# EAGLE design PowerBoard (EAGLE 9.6.2)
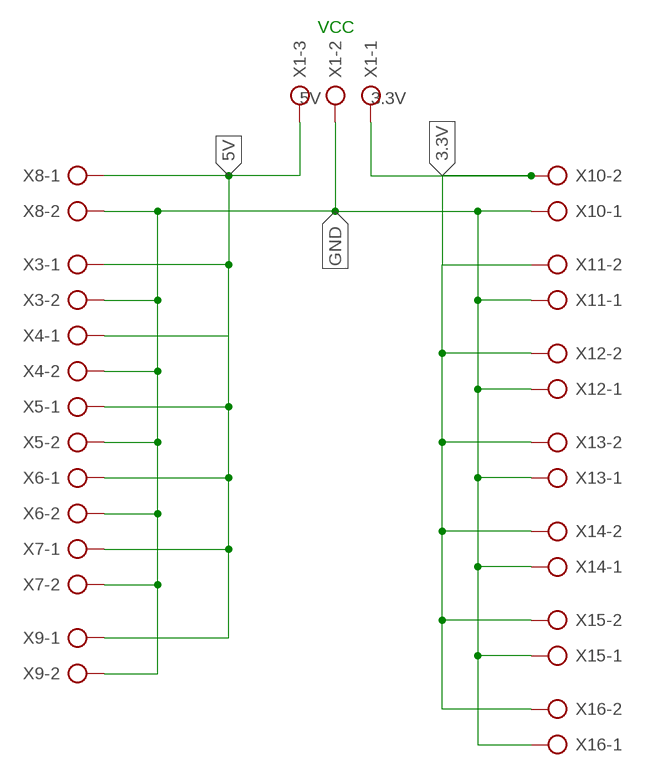
[diagram p0: schematic, sheet 1]

## Parts
X1  AK500/3  [AK500/3]
X3  AK500/2  [AK500/2]
X4  AK500/2  [AK500/2]
X5  AK500/2  [AK500/2]
X6  AK500/2  [AK500/2]
X7  AK500/2  [AK500/2]
X8  AK500/2  [AK500/2]
X9  AK500/2  [AK500/2]
X10  AK500/2  [AK500/2]
X11  AK500/2  [AK500/2]
X12  AK500/2  [AK500/2]
X13  AK500/2  [AK500/2]
X14  AK500/2  [AK500/2]
X15  AK500/2  [AK500/2]
X16  AK500/2  [AK500/2]

## Nets
3.3V: X1.1 X10.2 X11.2 X12.2 X13.2 X14.2 X15.2 X16.2
5V: X1.3 X3.1 X4.1 X5.1 X6.1 X7.1 X8.1 X9.1
GND: X1.2 X3.2 X4.2 X5.2 X6.2 X7.2 X8.2 X9.2 X10.1 X11.1 X12.1 X13.1 X14.1 X15.1 X16.1

## Notes on the sheet
- VCC
- 5V | 3.3V

## Library data of the parts
X1 = con-ptr500:AK500/3: CONNECTOR; OC_FARNELL: unknown; OC_NEWARK: unknown
X3-X16 = con-ptr500:AK500/2: CONNECTOR; OC_FARNELL: unknown; OC_NEWARK: unknown

## Board
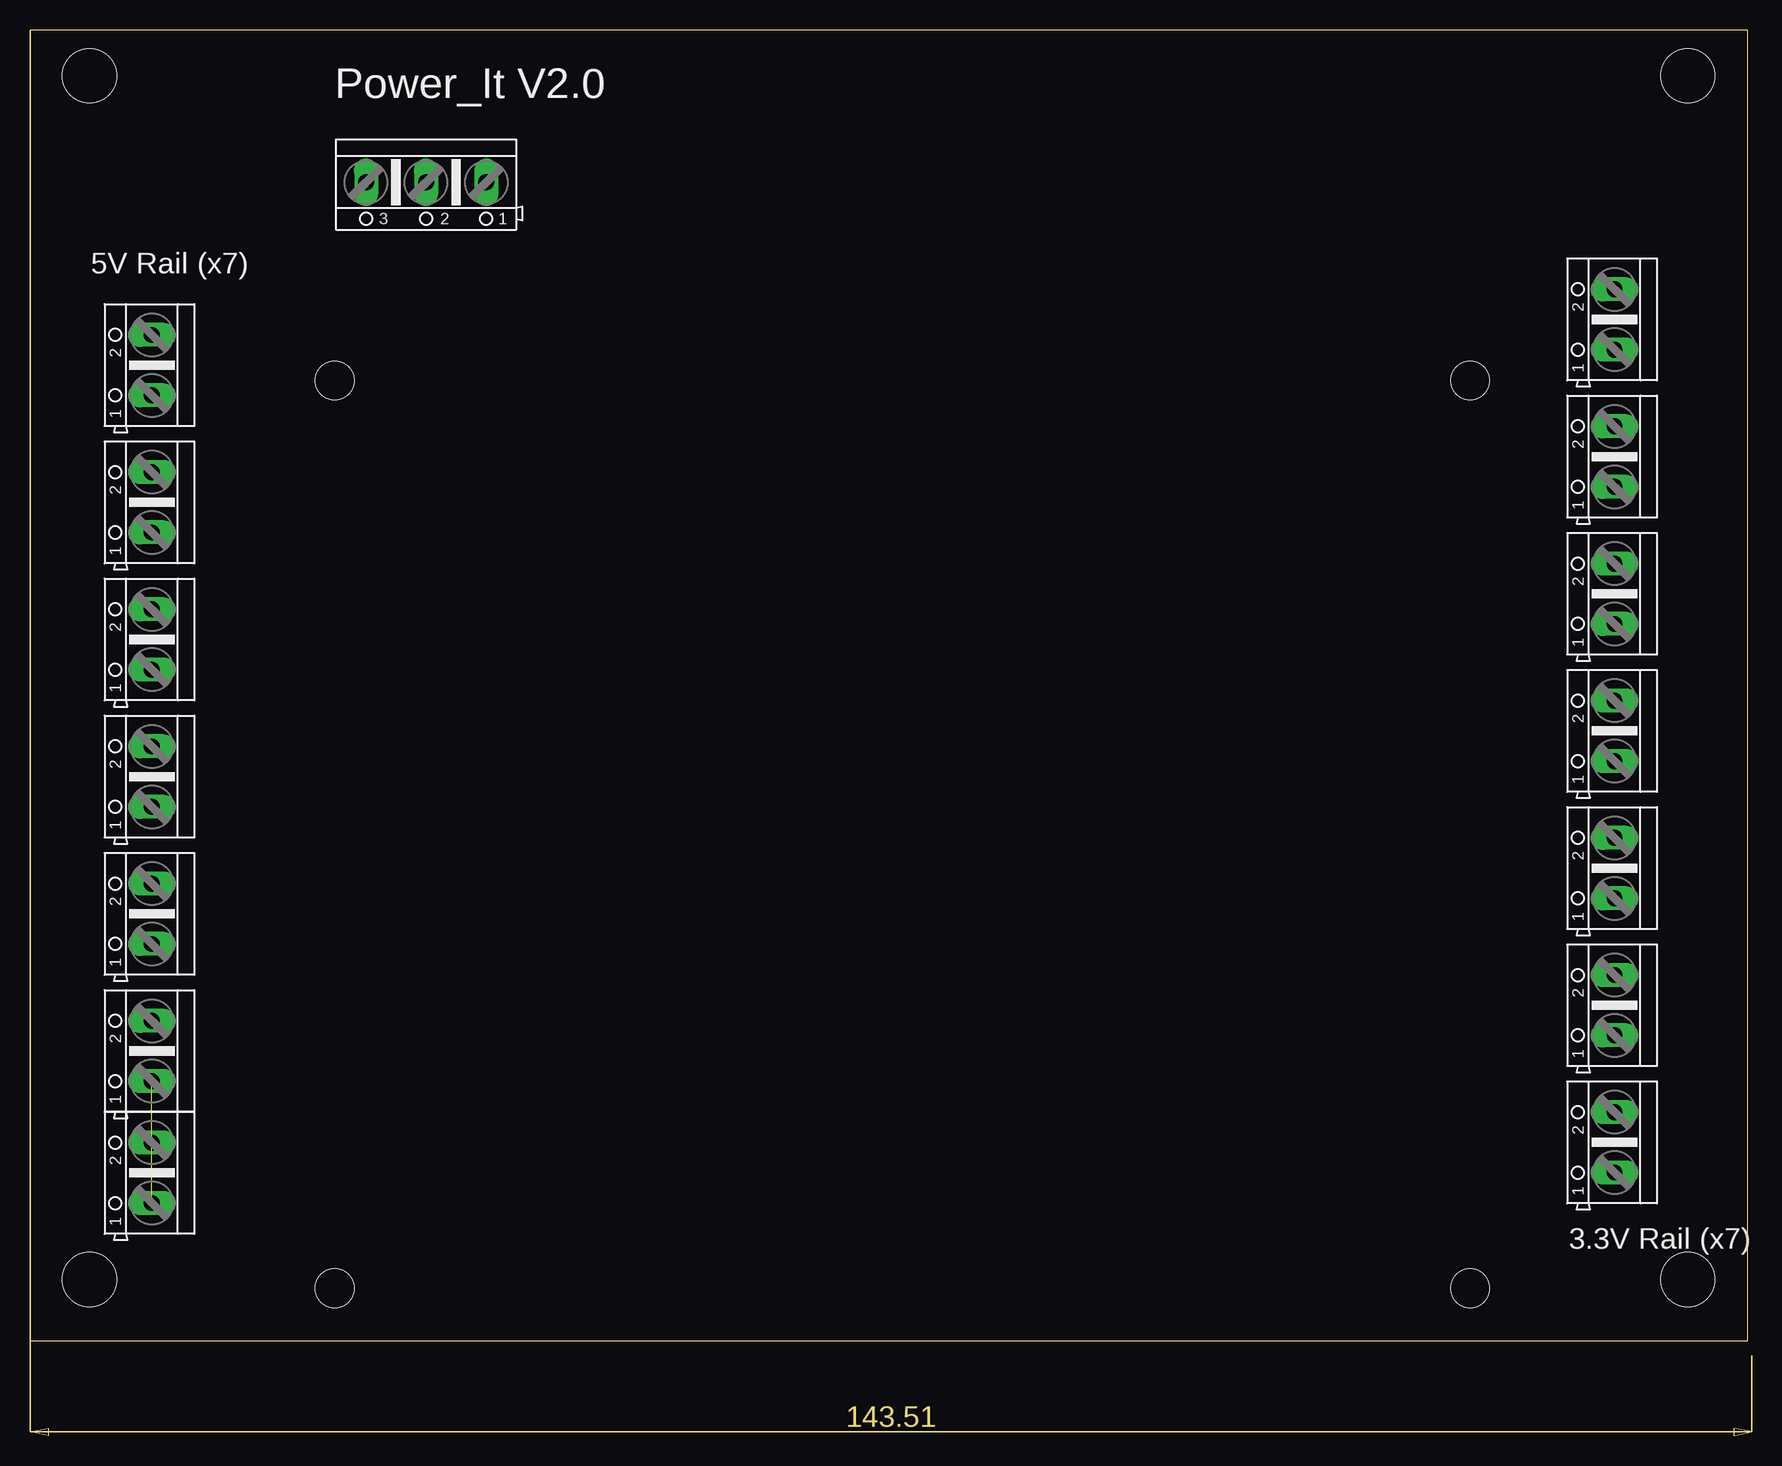
[diagram p1: board, top side]
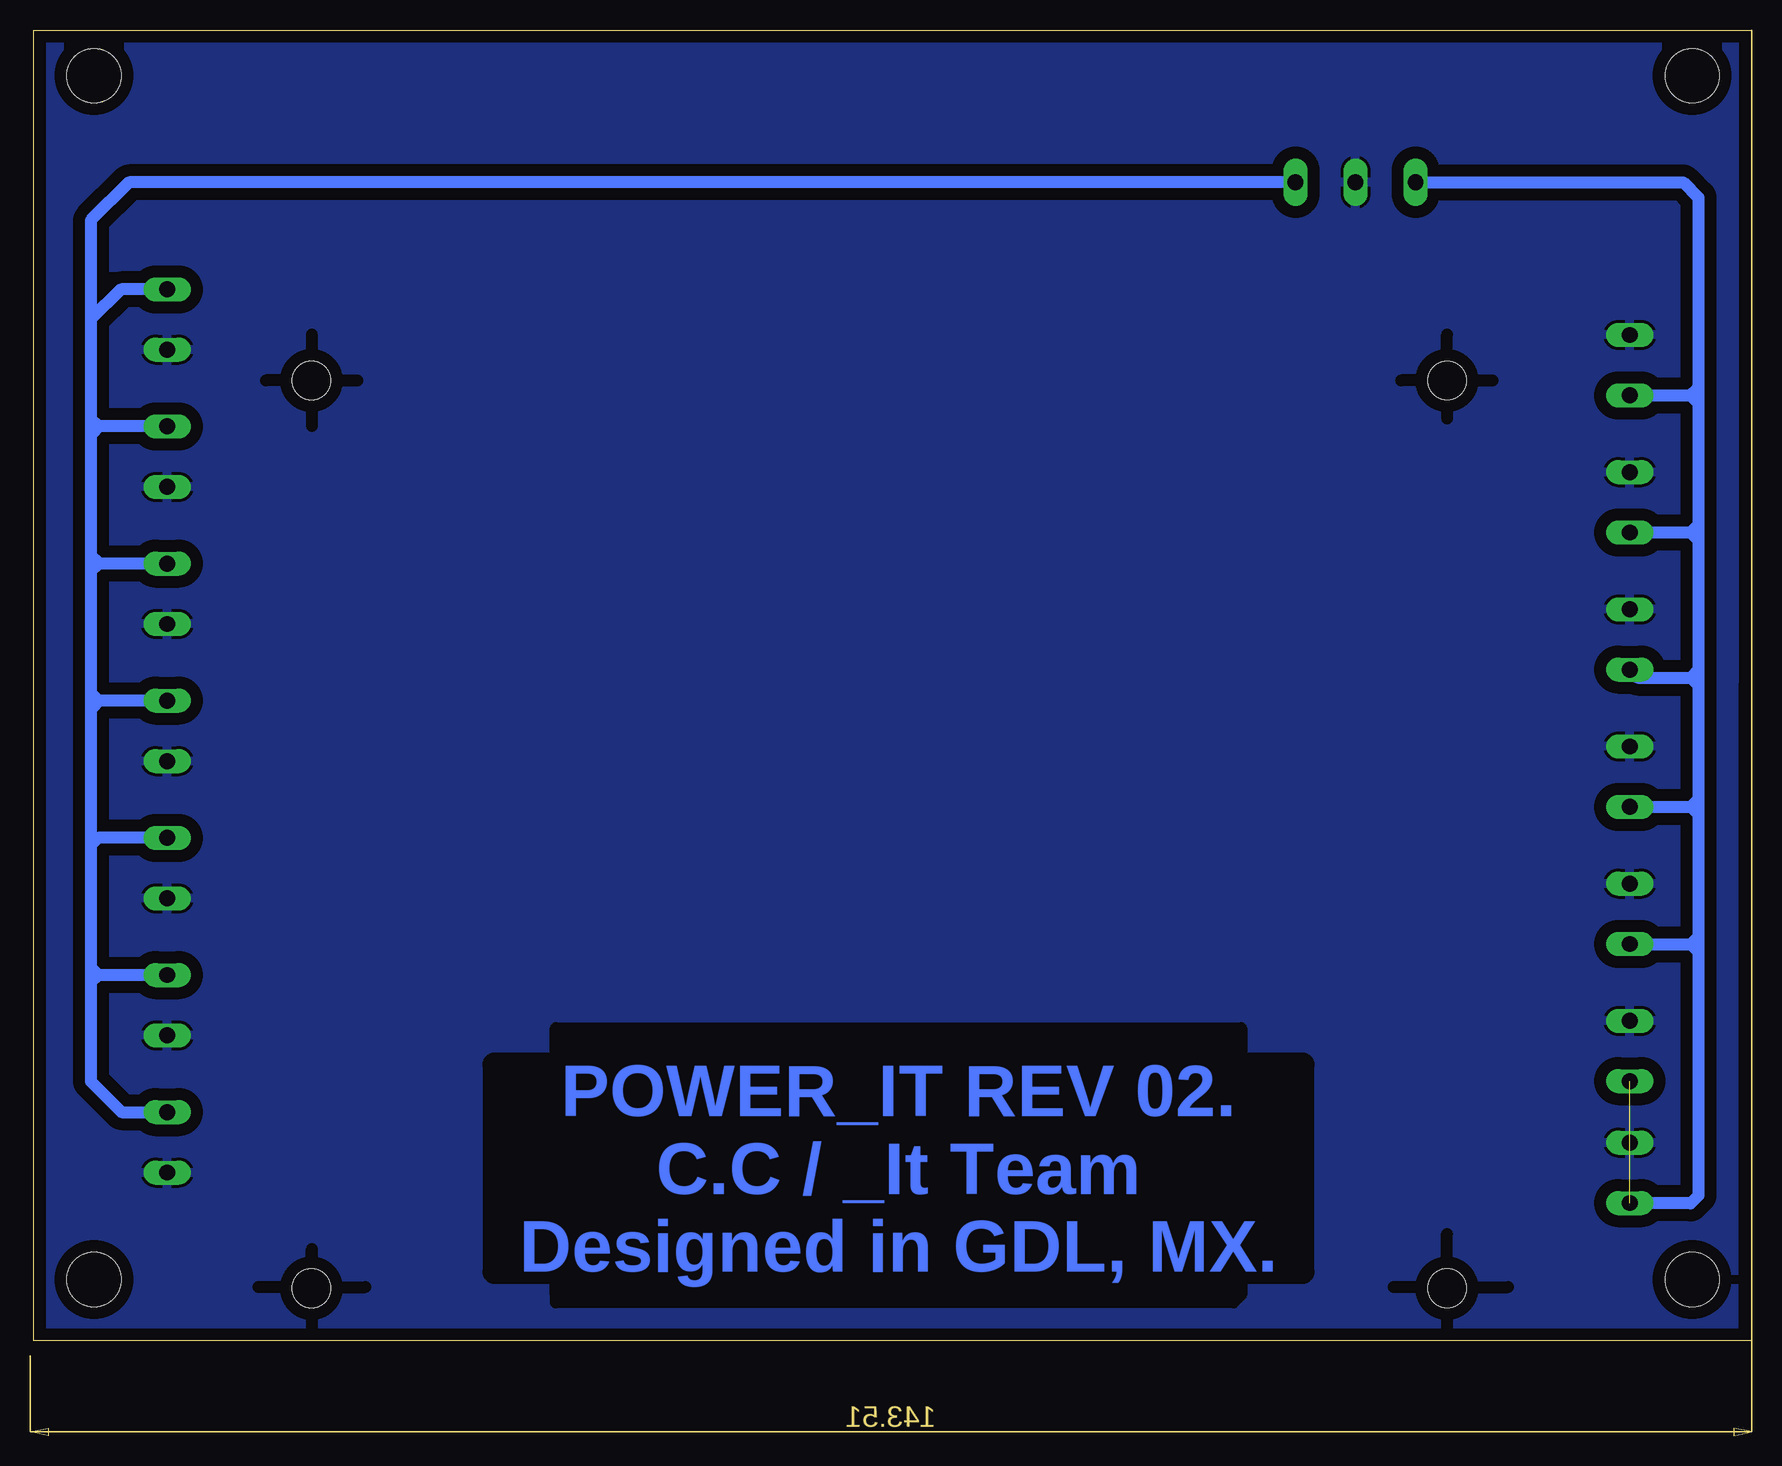
[diagram p2: board, bottom side, seen from below]

Size 143.18 x 109.21 mm. Coordinates in mm from the lower left corner, seen from the top.
Outline: 0,0 143.18,0 143.18,109.21 0,109.21 0,0
Copper layers (1*16): Top 0.035mm / dielectric 1.5mm / Bottom 0.035mm
Design rules "PowerBoard": minimum track width 1mm, minimum drill 0.35mm, track to track 1mm, track to pad 1mm, pad to pad 0.205mm, via to via 0.205mm, smd to smd 6mil, copper to edge 40mil, drill to drill 6mil, minimum pad ring 10mil, minimum via ring 8mil, stop-mask expansion 4mil, vias tented up to drill 0mil, thermal gap 10mil
Holes 3.2 mm at 25.4,4.36 25.4,80.01 120.05,4.36 120.05,80.01
Holes 4.5 mm at 4.95,5.08 4.95,105.41 138.18,105.41 138.18,5.08
bRestrict: 23 lines

### Footprints (pad centres in the part's own frame; a part is rotated, then mirrored left to right if it is on the bottom)
AK500/3 = drill 1.321 long: 1 -5.004,0; 2 0,0; 3 5.004,0
AK500/2 = drill 1.321 long: 1 -2.515,0; 2 2.515,0

### Placement (x,y rotation side)
X1  33.02,96.52 180 top
X3  10.16,81.28 90 top
X4  10.16,69.85 90 top
X5  10.16,58.42 90 top
X6  10.16,46.99 90 top
X7  10.16,35.56 90 top
X8  10.16,24.13 90 top
X9  10.16,13.97 90 top
X10  132.08,85.09 90 top
X11  132.08,73.66 90 top
X12  132.08,62.23 90 top
X13  132.08,50.8 90 top
X14  132.08,39.37 90 top
X15  132.08,27.94 90 top
X16  132.08,16.51 90 top

### Tracks (layer width: path | path; a pad name or v marks a point on that pad's centre or on a via)
3.3V
  Bottom 1.016: X10.2 135.91,87.61 138.43,85.09 | X16.2 135.87,19.02 138.43,21.59 138.43,29.84 | 138.43,85.09 138.43,76.83 | 138.43,76.83 138.43,75.56 | 138.43,75.56 138.43,65.41 | 138.43,65.41 138.43,64.14 | 138.43,64.14 138.43,53.98 | 138.43,53.98 138.43,52.7 | 138.43,52.7 138.43,41.27 | 138.43,41.27 138.43,31.11 | 138.43,31.11 138.43,29.84 | X11.2 137.77,76.17 | 138.43,76.83 137.77,76.17 | X12.2 137.82,64.75 | 138.43,64.14 137.82,64.75 | X13.2 137.77,53.31 | 138.43,53.98 137.77,53.31 | X14.2 137.82,41.88 138.43,41.27 | X15.2 137.77,30.45 | 137.77,30.45 138.43,31.11 | X1.1 135.25,96.52 138.43,93.34 138.43,85.09 | 137.77,76.17 138.38,75.56 138.43,75.56 | 137.82,64.75 137.82,64.8 138.43,65.41 | 137.77,53.31 138.38,52.7 138.43,52.7 | 137.77,30.45 137.82,30.45 138.43,29.84
5V  (1 unrouted)
  Bottom 1.016: 4.45,78.11 5.11,78.77 | 4.45,78.11 4.45,67.94 | 4.45,67.94 4.45,67.31 | 4.45,67.31 4.45,66.67 | 4.45,66.67 4.45,55.88 | 4.45,55.88 4.45,55.24 | 4.45,55.24 4.45,54.61 | 4.45,54.61 4.45,45.09 | 4.45,45.09 4.45,44.45 | 4.45,44.45 4.45,43.84 | 4.45,43.84 4.45,33.66 | 4.45,33.66 4.45,33.02 | 4.45,33.02 4.45,32.38 | 4.45,32.38 4.45,12.06 5.08,11.43 10.13,11.43 X9.1 | X4.1 5.08,67.33 | 5.08,67.33 4.47,67.33 4.45,67.31 | X5.1 9.5,55.24 5.08,55.24 | 5.08,55.24 4.45,55.24 | X6.1 5.08,44.48 | 5.08,44.48 4.47,44.48 4.45,44.45 | X7.1 10.13,33.02 5.08,33.02 | 5.08,33.02 4.45,33.02 | X3.1 5.11,78.77 | X1.3 5.71,96.52 4.45,95.25 4.45,79.38 | 4.45,79.38 4.45,78.11 | 5.11,78.77 4.5,79.38 4.45,79.38 | 5.08,67.33 4.47,67.94 4.45,67.94 | 5.08,67.33 5.08,67.31 4.45,66.67 | 4.45,55.88 5.08,55.24 | 5.08,55.24 4.45,54.61 | 5.08,44.48 4.47,45.09 4.45,45.09 | 5.08,44.48 4.45,43.84 | 4.45,33.66 5.08,33.02 | 5.08,33.02 4.45,32.38
GND
  pour Bottom: -16.51,109.22 143.51,109.22 143.51,1.27 144.15,0.64 0.64,0.64 0,0 0,92.71 -15.88,108.58

### Text on the board
Bottom: POWER_IT REV 02. / C.C / _It Team / Designed in GDL, MX.
tPlace: Power_It V2.0 | 5V Rail (x7) | 3.3V Rail (x7)